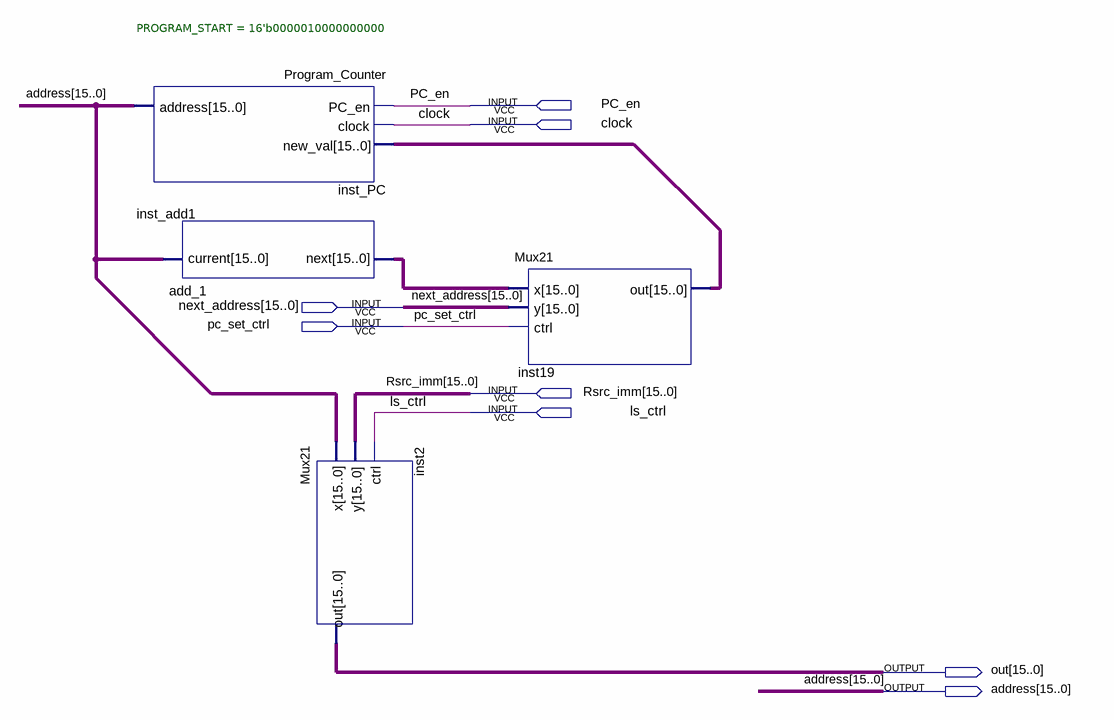
[diagram p0: schematic sheet]
// Quartus schematic InstructionCounter.bdf as structural Verilog: 4 symbols, 8 pins
module InstructionCounter (
  input  PC_en,
  input  clock,
  input  [15:0] next_address,
  input  pc_set_ctrl,
  input  [15:0] Rsrc_imm,
  input  ls_ctrl,
  output [15:0] out,
  output [15:0] address
);

  wire [15:0] inst19_out, inst_add1_next;

  Program_Counter #(.PROGRAM_START(16'b0000010000000000)) inst_PC (
    .PC_en(PC_en), .clock(clock), .new_val(inst19_out), .address(address));
  add_1 inst_add1 (.current(address), .next(inst_add1_next));
  Mux21 inst2 (.x(address), .y(Rsrc_imm), .ctrl(ls_ctrl), .out(out));
  Mux21 inst19 (.x(inst_add1_next), .y(next_address), .ctrl(pc_set_ctrl), .out(inst19_out));
endmodule
